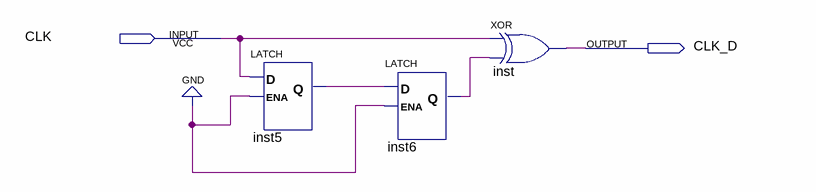
[diagram p0: schematic sheet]
// Quartus schematic clk_doubler.bdf as structural Verilog: 3 symbols, 2 pins
module clk_doubler (
  input  CLK,
  output CLK_D
);

  wire inst5_q, inst6_q;

  LATCH inst5 (.D(CLK), .ENA(1'b0), .Q(inst5_q));
  LATCH inst6 (.D(inst5_q), .ENA(1'b0), .Q(inst6_q));
  xor inst (CLK_D, CLK, inst6_q);
endmodule
